# Altium schematic sheet E17-04_ICS.SchDoc
size A; DocumentNumber: 18; SheetNumber: 18; SheetTotal: 18
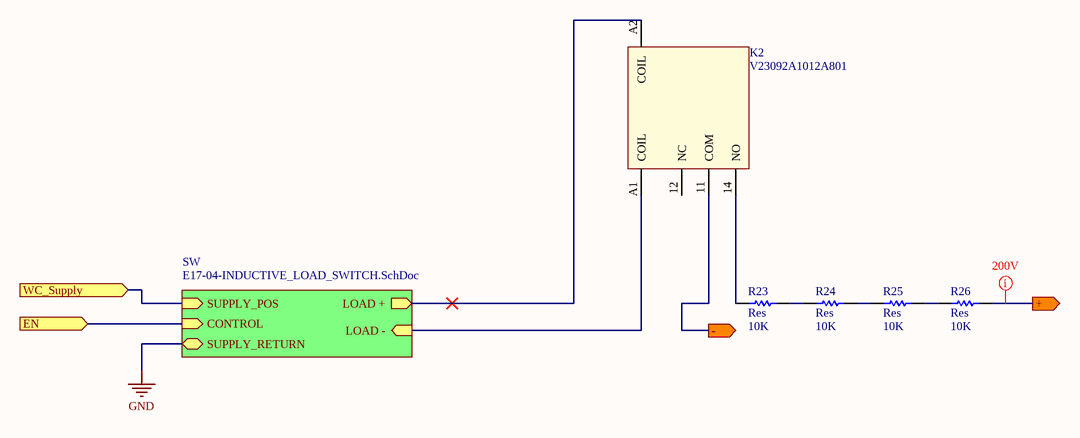
[diagram p0: E17-04_ICS.SchDoc]

## Parts
K2  V23092A1012A801  [SCHRACK]
R23  Res  value 10K  [3216[1206]]
R24  Res  value 10K  [3216[1206]]
R25  Res  value 10K  [3216[1206]]
R26  Res  value 10K  [3216[1206]]

## Sub-sheets
SW = E17-04-INDUCTIVE_LOAD_SWITCH.SchDoc: CONTROL (in), LOAD + (out), SUPPLY_POS (in), LOAD - (in), SUPPLY_RETURN

## Ports
+ (out), - (out), EN (in), WC_Supply (in)

## Nets
GND: sheet SW/SUPPLY_RETURN
+: R26.2 ; port +
-: K2.11(COM) ; port -
EN: port EN, sheet SW/CONTROL
WC_Supply: port WC_Supply, sheet SW/SUPPLY_POS
NetK2_14: K2.14(NO) R23.1
NetK2_A1: K2.A1(COIL) ; sheet SW/LOAD -
NetK2_A2: K2.A2(COIL) ; sheet SW/LOAD +
NetR23_2: R23.2 R24.1
NetR24_2: R24.2 R25.1
NetR25_2: R25.2 R26.1

Not connected (* = marked no-connect by the designer): K2 12(NC)

## Layout directives
rule Clearance Constraint [Generic clearance = 0.4mm, and 3 value(s) for objects]: +

## Library data of the parts
K2 = V23092A1012A801: 12V slim SPDT Relay; MFG: TE; DC Contact Voltage: 300; Coil Voltage: 12; Coil Current: 0.0142; DIGIKEY_PN: PB2044-ND; Supplier 1: Digikey; Supplier Part Number 1: PB2044-ND; MFG_PN: V23092A1012A801
R23-R26 = Res: Surface Mount Resistor; Published: 8-Jun-2000; LatestRevisionDate: 17-Jul-2002; LatestRevisionNote: Re-released for DXP Platform.; PackageReference: AXIAL-0.5; Publisher: Altium Limited